# Altium project PowerSupply.PrjPCB
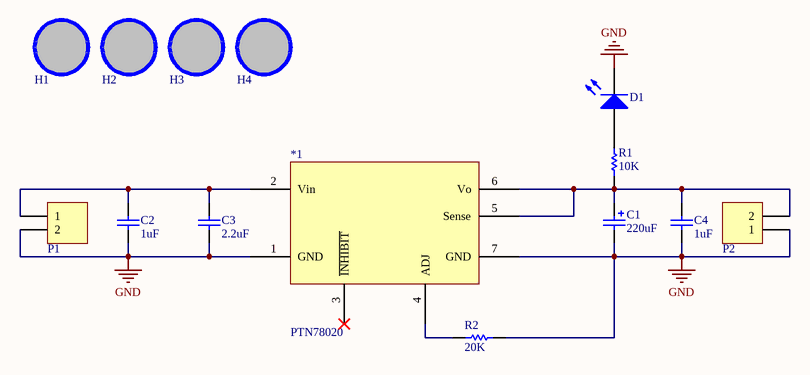
[diagram p0: Sheet1.SchDoc]
1 sheet, 14 parts. Net scope: global (net labels, ports and power ports of the same name join across sheets).
Board file: PCB1.PcbDoc

## Sheet Sheet1.SchDoc
size A

### Parts
*1  PTN78020  [PTN78020H]
C1  value 220uF  [CAP ALU SIZE D]  (hidden comment: Cap Pol SMD)
C2  value 1uF  [CAP-SM-0603]  (hidden comment: Cap Non-Pol SMD)
C3  value 2.2uF  [CAP-SM-0603]  (hidden comment: Cap Non-Pol SMD)
C4  value 1uF  [CAP-SM-0603]  (hidden comment: Cap Non-Pol SMD)
D1  LED SMD  [LED_0603_Blue]  (value not drawn)
H1  Hole  [LO KHOAN 3MM]  (value not drawn)
H2  Hole  [LO KHOAN 3MM]  (value not drawn)
H3  Hole  [LO KHOAN 3MM]  (value not drawn)
H4  Hole  [LO KHOAN 3MM]  (value not drawn)
P1  Domino 2  [DOMINO 2- 5mm]  (value not drawn)
P2  Domino 2  [DOMINO 2- 5mm]  (value not drawn)
R1  value 10K  [RES-SM-0603]  (hidden comment: RESISTOR SMD)
R2  value 20K  [RES-SM-0603]  (hidden comment: RESISTOR SMD)

### Nets
GND: *1.1(GND) *1.7(GND) C1.2 C2.1 C3.1 C4.1 D1.2(K) P1.2 P2.1 R2.2
Net*1_2: *1.2(Vin) C2.2 C3.2 P1.1
Net*1_4: *1.4(ADJ) R2.1
Net*1_5: *1.5(Sense) *1.6(Vo) C1.1 C4.2 P2.2 R1.1
NetD1_1: D1.1(A) R1.2

Not connected (* = marked no-connect by the designer): *1 3(~{INHIBIT})*; H1 1; H2 1; H3 1; H4 1

### Library data of the parts
C1 = Cap Pol SMD: Polarized Capacitor (Radial)
C2-C4 = Cap Non-Pol SMD: Capacitor
D1 = LED SMD: LED
H1-H4 = Hole: Hole 3mm
P1 P2 = Domino 2: Domino, 2-Pin; LatestRevisionDate: 17-Jul-2002; LatestRevisionNote: Re-released for DXP Platform.; Publisher: Altium Limited
R1 R2 = RESISTOR SMD: Resistor